# EAGLE design conrad (EAGLE 7.6.0)
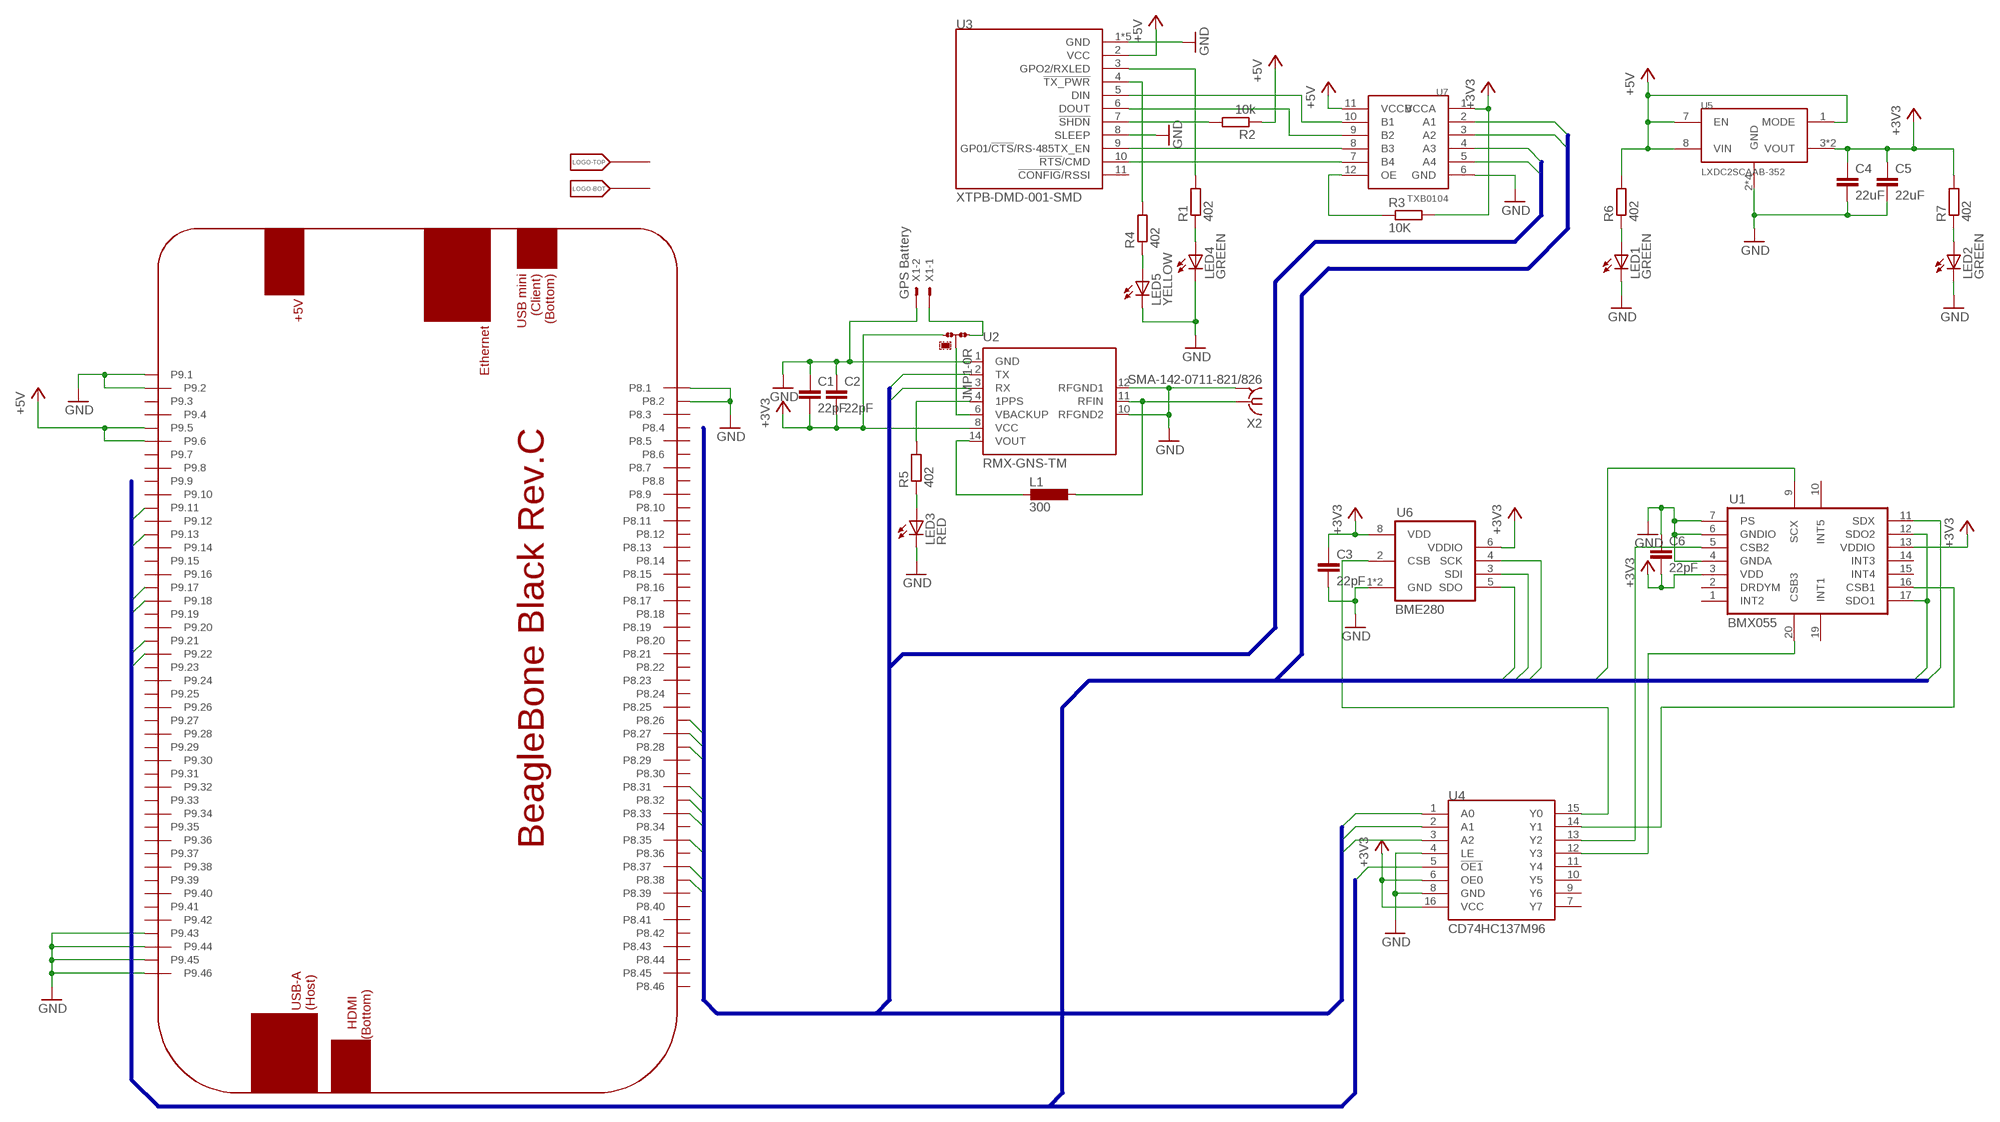
[diagram p0: schematic, sheet 1]

## Parts
C1  22pF  C-EUC0603K  [C0603K]
C2  22pF  C-EUC0603K  [C0603K]
C3  22pF  C-EUC0603K  [C0603K]
C4  22uF  C-EUC0603K  [C0603K]
C5  22uF  C-EUC0603K  [C0603K]
C6  22pF  C-EUC0603K  [C0603K]
JMP1  0R-JUMPB  [B0R-JMP]
L1  300  L-EU  [L0402]
LED1  GREEN  LEDSML0805  [SML0805]
LED2  GREEN  LEDSML0805  [SML0805]
LED3  RED  LEDSML0805  [SML0805]
LED4  GREEN  LEDSML0805  [SML0805]
LED5  YELLOW  LEDSML0805  [SML0805]
LOGO  SU_LOGO-DUMMY  [SU_LOGO_DS]
PCB1  BEAGLEBONE_BLACK_CAPE  [BEAGLEBONE_BLACK_CAPE]
R1  402  R-EU_R0603  [R0603]
R2  10k  R-EU_R0603  [R0603]
R3  10K  R-EU_R0603  [R0603]
R4  402  R-EU_R0603  [R0603]
R5  402  R-EU_R0603  [R0603]
R6  402  R-EU_R0603  [R0603]
R7  402  R-EU_R0603  [R0603]
U1  BMX055  [BMX055]
U2  RMX-GNS-TM  [RMX-GNSS-TM]
U3  XTPB-DMD-001-SMD  [XTP9B-DMS-001-SMD]
U4  CD74HC137M96  CD74HC237M96  [SO-16]
U5  LXDC2SCAAB-352  [LXDC2SCAAB-352]
U6  BME280  [BME280]
U7  TXB0104  [R-PUQFN-N12]
X1  GPS Battery  C-GRID-02-15-19  [15-91-02]
X2  SMA-142-0711-821/826  [J502-ND-142-0711-821/826]

## Nets
+3V3: C1.2 C2.2 C3.1 C4.1 C5.1 C6.2 JMP1.3 R3.2 R7.2 U1.3(VDD) U1.13(VDDIO) U2.8(VCC) U4.6(OE0) U4.16(VCC) U5.3(VOUT) U5.4(VOUT) U6.6(VDDIO) U6.8(VDD) U7.1(VCCA)
+5V: PCB1.P9.5 PCB1.P9.6 R2.1 R6.2 U3.2(VCC) U5.1(MODE) U5.7(EN) U5.8(VIN) U7.11(VCCB)
GND: C1.1 C2.1 C3.2 C4.2 C5.2 C6.1 LED1.C LED2.C LED3.C LED4.C LED5.C PCB1.P8.1 PCB1.P8.2 PCB1.P9.1 PCB1.P9.2 PCB1.P9.43 PCB1.P9.44 PCB1.P9.45 PCB1.P9.46 U1.4(GNDA) U1.6(GNDIO) U1.7(PS) U2.1(GND) U2.10(RFGND2) U2.12(RFGND1) U3.1(GND) U3.8(SLEEP) U3.P$1(GND) U3.P$2(GND) U3.P$3(GND) U3.P$4(GND) U4.4(LE) U4.8(GND) U5.2(GND) U5.5(GND) U5.6(GND) U5.9(GND) U6.1(GND) U6.7(GND) U7.6(GND) X1.2 X2.G@1 X2.G@2 X2.G@3 X2.G@4
N$1: R3.1 U7.12(OE)
N$2: LED4.A R1.1
N$3: U3.6(DOUT) U7.9(B2)
N$4: R4.2 U3.4(!TX_PWR!)
N$5: L1.1 U2.11(RFIN) X2.1
N$6: JMP1.1 X1.1
N$7: U4.15(Y0) U6.2(CSB)
N$8: U1.5(CSB2) U4.13(Y2)
N$9: L1.2 U2.14(VOUT)
N$10: U1.16(CSB1) U4.14(Y1)
N$11: R1.2 U3.3(GPO2/RXLED)
N$12: U1.20(CSB3) U4.12(Y3)
N$13: R5.2 U2.4(1PPS)
N$14: LED5.A R4.1
N$15: R2.2 U3.7(!SHDN!)
N$16: LED3.A R5.1
N$17: LED1.A R6.1
N$18: LED2.A R7.1
SPI0_CS0: PCB1.P9.17 U4.5(!OE1!)
SPI0_D0: PCB1.P9.21 U1.12(SDO2) U1.17(SDO1) U6.5(SDO)
SPI0_D1: PCB1.P9.18 U1.11(SDX) U6.3(SDI)
SPI0_SCLK: PCB1.P9.22 U1.9(SCX) U6.4(SCK)
SPI_CSB26: PCB1.P8.26 U4.1(A0)
SPI_CSB27: PCB1.P8.27 U4.2(A1)
SPI_CSB28: PCB1.P8.28 U4.3(A2)
UART4_CTSN: PCB1.P8.35 U7.4(A3)
UART4_CTSN_HV: U3.9(GP01/!CTS!/RS-485TX_EN) U7.8(B3)
UART4_RTSN: PCB1.P8.33 U7.5(A4)
UART4_RTSN_HV: U3.10(!RTS!/CMD) U7.7(B4)
UART4_RXD: PCB1.P9.11 U7.3(A2)
UART4_TXD: PCB1.P9.13 U7.2(A1)
UART4_TXD-HV: U3.5(DIN) U7.10(B1)
UART5_CTSN: PCB1.P8.31
UART5_RTSN: PCB1.P8.32
UART5_RXD: PCB1.P8.38 U2.2(TX)
UART5_TXD: PCB1.P8.37 U2.3(RX)
VBACKUP: JMP1.2 U2.6(VBACKUP)
Unconnected: LOGO.P$1 LOGO.P$2 PCB1.P8.3 PCB1.P8.4 PCB1.P8.5 PCB1.P8.6 PCB1.P8.7 PCB1.P8.8 PCB1.P8.9 PCB1.P8.10 PCB1.P8.11 PCB1.P8.12 PCB1.P8.13 PCB1.P8.14 PCB1.P8.15 PCB1.P8.16 PCB1.P8.17 PCB1.P8.18 PCB1.P8.19 PCB1.P8.20 PCB1.P8.21 PCB1.P8.22 PCB1.P8.23 PCB1.P8.24 PCB1.P8.25 PCB1.P8.29 PCB1.P8.30 PCB1.P8.34 PCB1.P8.36 PCB1.P8.39 PCB1.P8.40 PCB1.P8.41 PCB1.P8.42 PCB1.P8.43 PCB1.P8.44 PCB1.P8.45 PCB1.P8.46 PCB1.P9.3 PCB1.P9.4 PCB1.P9.7 PCB1.P9.8 PCB1.P9.9 PCB1.P9.10 PCB1.P9.12 PCB1.P9.14 PCB1.P9.15 PCB1.P9.16 PCB1.P9.19 PCB1.P9.20 PCB1.P9.23 PCB1.P9.24 PCB1.P9.25 PCB1.P9.26 PCB1.P9.27 PCB1.P9.28 PCB1.P9.29 PCB1.P9.30 PCB1.P9.31 PCB1.P9.32 PCB1.P9.33 PCB1.P9.34 PCB1.P9.35 PCB1.P9.36 PCB1.P9.37 PCB1.P9.38 PCB1.P9.39 PCB1.P9.40 PCB1.P9.41 PCB1.P9.42 U1.1(INT2) U1.2(DRDYM) U1.10(INT5) U1.14(INT3) U1.15(INT4) U1.19(INT1) U3.11(!CONFIG!/RSSI) U4.7(Y7) U4.9(Y6) U4.10(Y5) U4.11(Y4)

## Buses
P8:UART4_RTSN,UART4_CTSN,UART5_CTSN,UART5_RTSN,UART5_TXD,UART5_RXD,SPI_CSB[26..28]
P9:UART4_RXD,UART4_TXD,SPI0_CS0,SPI0_D1,SPI0_D0,SPI0_SCLK

## Library data of the parts
C1-C6 = resistor:C-EU: CAPACITOR, European symbol
JMP1 = jump-0r-smd:0R-JUMP: SMD 0R 0805 Jumper
L1 = components:L-EU
LED1-LED5 = led:LED: LED OSRAM: - CHIPLED LG R971, LG N971, LY N971, LG Q971, LY Q971, LO R971, LY R971 LH N974, LH R974 LS Q976, LO Q976, LY Q976 LO Q996 - Hyper CHIPLED LW Q18S LB Q993, LB Q99A, LB R99A - SideLED LS A670, LO A670, LY A670, LG A670, LP A670 LB A673, LV A673, LT A673, LW A673 LH A674 LY A675 LS A676, LA A676, LO A676, LY A676, LW A676 LS A679, LY A679, LG A679 - Hyper Micro SIDELED® LS Y876, LA Y876, LO Y876, LY Y876 LT Y87S - SmartLED LW L88C, LW L88S LB L89C, LB L89S, LG L890 LS L89K, LO L89K, LY L89K LS L896, LA L896, LO L896, LY L896 - TOPLED LS T670, LO T670, LY T670, LG T670, LP T670 LSG T670, LSP T670, LSY T670, LOP T670, LYG T670 LG T671, LOG T671, LSG T671 LB T673, LV T673, LT T673, LW T673 LH T674 LS T676, LA T676, LO T676, LY T676, LB T676, LH T676, LSB T676, LW T676 LB T67C, LV T67C, LT T67C, LS T67K, LO T67K, LY T67K, LW E67C LS E67B, LA E67B, LO E67B, LY E67B, LB E67C, LV E67C, LT E67C LW T67C LS T679, LY T679, LG T679 LS T770, LO T770, LY T770, LG T770, LP T770 LB T773, LV T773, LT T773, LW T773 LH T774 LS E675, LA E675, LY E675, LS T675 LS T776, LA T776, LO T776, LY T776, LB T776 LHGB T686 LT T68C, LB T68C - Hyper Mini TOPLED® LB M676 - Mini TOPLED Santana® LG M470 LS M47K, LO M47K, LY M47K Source: http://www.osram.convergy.de LUXEON: - LUMILED® LXK2-PW12-R00, LXK2-PW12-S00, LXK2-PW14-U00, LXK2-PW14-V00 LXK2-PM12-R00, LXK2-PM12-S00, LXK2-PM14-U00 LXK2-PE12-Q00, LXK2-PE12-R00, LXK2-PE12-S00, LXK2-PE14-T00, LXK2-PE14-U00 LXK2-PB12-K00, LXK2-PB12-L00, LXK2-PB12-M00, LXK2-PB14-N00, LXK2-PB14-P00, LXK2-PB14-Q00 LXK2-PR12-L00, LXK2-PR12-M00, LXK2-PR14-Q00, LXK2-PR14-R00 LXK2-PD12-Q00, LXK2-PD12-R00, LXK2-PD12-S00 LXK2-PH12-R00, LXK2-PH12-S00 LXK2-PL12-P00, LXK2-PL12-Q00, LXK2-PL12-R00 Source: www.luxeon.com KINGBRIGHT: KA-3528ASYC Source: www.kingbright.com
LOGO = components:SU_LOGO-DUMMY
PCB1 = e14_BeagleBoneBlack_RevB:BEAGLEBONE_BLACK_CAPE
R1-R7 = rcl:R-EU_: RESISTOR, European symbol
U1 = bosch:BMX055: BOSH BMX055 Accelerometer
U2 = linx:RMX-GNS-TM: RMX-GNS-TM GNSS Reciver Module
U3 = XTend:XTPB-DMD-001-SMD: XTP9B-DMS-001-SMD board footprint with smd connector
U4 = texas:CD74HC237M96: CD74HC237M96 3 bit demultiplexer High output
U5 = murata:LXDC2SCAAB-352: LXDC2SCAAB-352 Micro DC-DC converter 1.2A max 2.8-5.0V input range 3.3V output
U6 = bosch:BME280: DIGITAL HUMIDITY, PRESSURE AND TEMPERATURE SENSOR * Digital interface I²C (up to 3.4 MHz) and SPI (3 and 4 wire, up to 10 MHz)* Supply voltage VDD main supply voltage range: 1.71 V to 3.6 V*VDDIO interface voltage range: 1.2 V to 3.6 V Operating range -40…+85 °C, 0…100 % rel. humidity, 300…1100 hPa The library has been designed by Richard Magdycz <https://www.facebook.com/groups/eaglecadsoftUK>
U7 = texas:TXB0104: Voltage-Level Translator 1.2V to 3.6V on A port and 1.65V to 5.5V on B port Voltage translator.
X1 = con-molex:C-GRID-02: CONNECTOR wire to board 2.54 mm (0.100") pitch header; OC_FARNELL: unknown; OC_NEWARK: unknown
X2 = con-coax:SMA-: SMA 50 Ohm End Launch Jack Receptacle - Round Contact Johnson Components Source: www.johnsoncomponents.com .. J502-ND.pdf; MF: JOHNSON COMPONENTS; MPN: 142-0711-821; OC_FARNELL: 1019328; OC_NEWARK: 16F3627

## Board
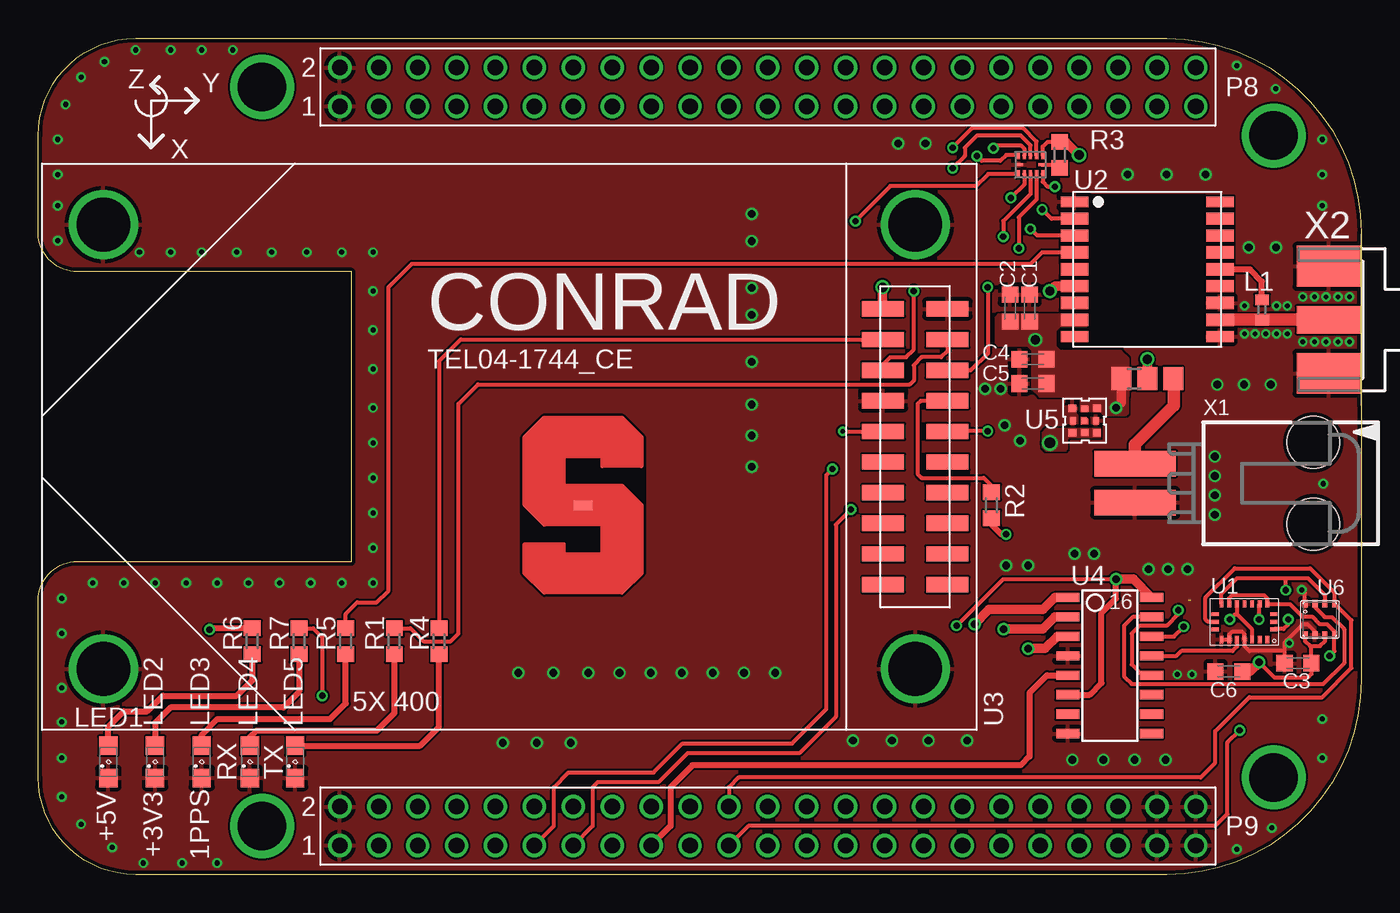
[diagram p1: board, top side]
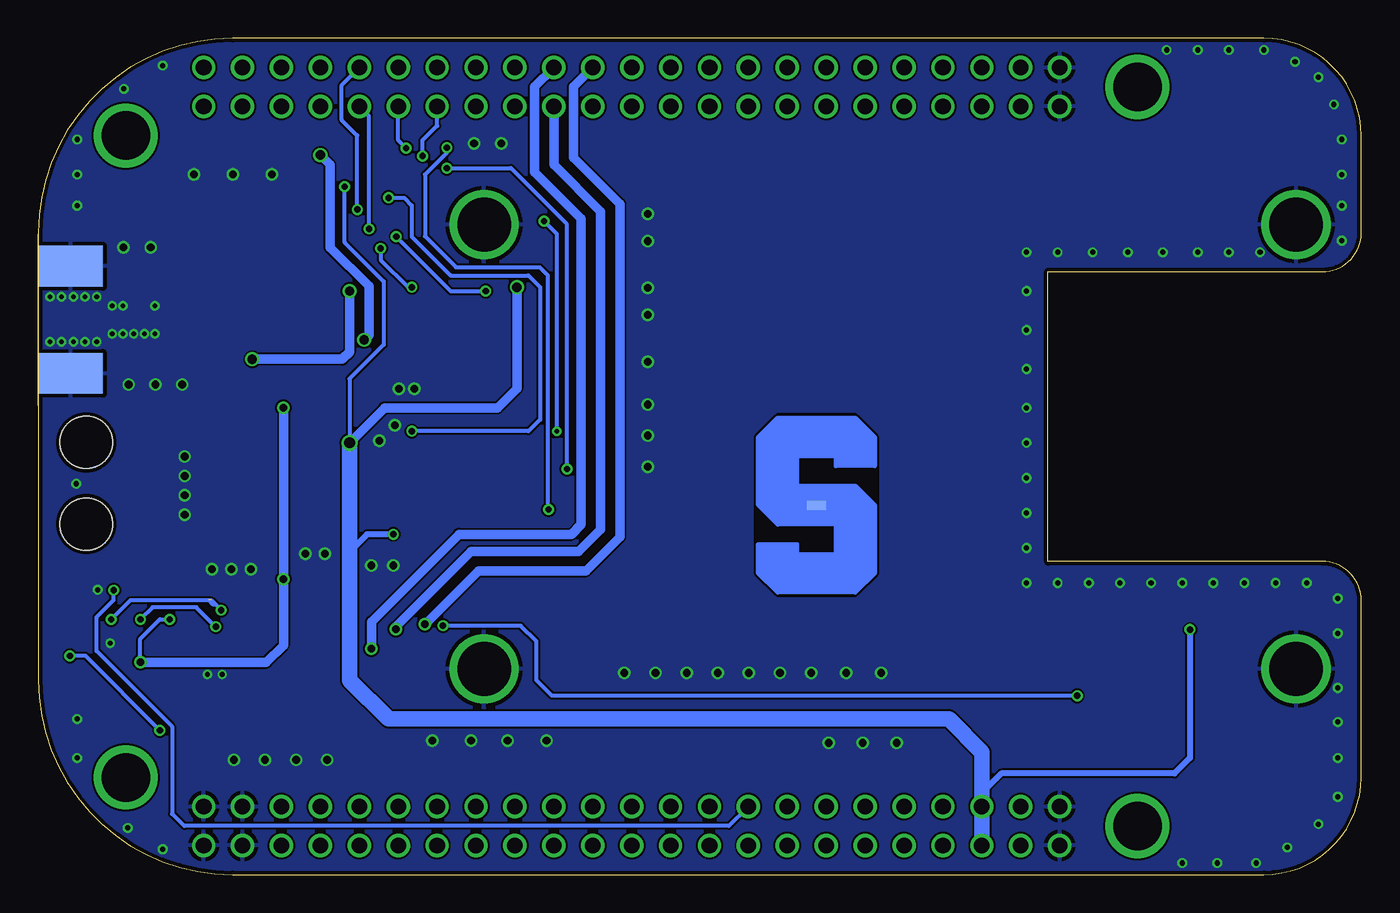
[diagram p2: board, bottom side, seen from below]

Size 86.36 x 54.61 mm. Coordinates in mm from the lower left corner, seen from the top.
Copper layers (1*16): Top 0.035mm / dielectric 1.5mm / Bottom 0.035mm
Design rules "DirtyPCBs-2layer": minimum track width 5mil, minimum drill 12mil, track to track 5mil, track to pad 5mil, pad to pad 5mil, via to via 5mil, smd to smd 0mil, copper to edge 10mil, drill to drill 10mil, minimum pad ring 10mil, minimum via ring 6mil, stop-mask expansion 2mil, vias tented up to drill 25mil, thermal gap 10mil
tRestrict: area 68.6,34.5 to 76.2,44.5; area 31.6,18.3 to 39.5,30
bRestrict: area 31.6,18.3 to 39.5,30

### Footprints (pad centres in the part's own frame; a part is rotated, then mirrored left to right if it is on the bottom)
C0603K = smd 1.05 x 1.08: 1 -0.875,0; 2 0.875,0
B0R-JMP = smd 1.5 x 1.3: 1 0,1.7; 2 0,0; 3 0,-1.7
L0402 = smd 0.7 x 0.9: 1 -0.65,0; 2 0.65,0
SML0805 = smd 1.2 x 1.2: A 1.05,0; C -1.05,0
SU_LOGO_DS = smd 1.27 x 0.635: P$1 0,0 | smd 1.27 x 0.635 bottom: P$2 0,0
BEAGLEBONE_BLACK_CAPE = drill 3.175: H1 14.605,3.175; H2 80.645,6.35; H3 80.645,48.26; H4 14.605,51.435 | drill 1.016: P8.1 19.685,50.165; P8.2 19.685,52.705; P8.3 22.225,50.165; P8.4 22.225,52.705; P8.5 24.765,50.165; P8.6 24.765,52.705; P8.7 27.305,50.165; P8.8 27.305,52.705; P8.9 29.845,50.165; P8.10 29.845,52.705; P8.11 32.385,50.165; P8.12 32.385,52.705; P8.13 34.925,50.165; P8.14 34.925,52.705; P8.15 37.465,50.165; P8.16 37.465,52.705; P8.17 40.005,50.165; P8.18 40.005,52.705; P8.19 42.545,50.165; P8.20 42.545,52.705; P8.21 45.085,50.165; P8.22 45.085,52.705; P8.23 47.625,50.165; P8.24 47.625,52.705; P8.25 50.165,50.165; P8.26 50.165,52.705; P8.27 52.705,50.165; P8.28 52.705,52.705; P8.29 55.245,50.165; P8.30 55.245,52.705; P8.31 57.785,50.165; P8.32 57.785,52.705; P8.33 60.325,50.165; P8.34 60.325,52.705; P8.35 62.865,50.165; P8.36 62.865,52.705; P8.37 65.405,50.165; P8.38 65.405,52.705; P8.39 67.945,50.165; P8.40 67.945,52.705; P8.41 70.485,50.165; P8.42 70.485,52.705; P8.43 73.025,50.165; P8.44 73.025,52.705; P8.45 75.565,50.165; P8.46 75.565,52.705; P9.1 19.685,1.905; P9.2 19.685,4.445; P9.3 22.225,1.905; P9.4 22.225,4.445; P9.5 24.765,1.905; P9.6 24.765,4.445; P9.7 27.305,1.905; P9.8 27.305,4.445; P9.9 29.845,1.905; P9.10 29.845,4.445; P9.11 32.385,1.905; P9.12 32.385,4.445; P9.13 34.925,1.905; P9.14 34.925,4.445; P9.15 37.465,1.905; P9.16 37.465,4.445; P9.17 40.005,1.905; P9.18 40.005,4.445; P9.19 42.545,1.905; P9.20 42.545,4.445; P9.21 45.085,1.905; P9.22 45.085,4.445; P9.23 47.625,1.905; P9.24 47.625,4.445; P9.25 50.165,1.905; P9.26 50.165,4.445; P9.27 52.705,1.905; P9.28 52.705,4.445; P9.29 55.245,1.905; P9.30 55.245,4.445; P9.31 57.785,1.905; P9.32 57.785,4.445; P9.33 60.325,1.905; P9.34 60.325,4.445; P9.35 62.865,1.905; P9.36 62.865,4.445; P9.37 65.405,1.905; P9.38 65.405,4.445; P9.39 67.945,1.905; P9.40 67.945,4.445; P9.41 70.485,1.905; P9.42 70.485,4.445; P9.43 73.025,1.905; P9.44 73.025,4.445; P9.45 75.565,1.905; P9.46 75.565,4.445
R0603 = smd 1 x 1.1: 1 -0.85,0; 2 0.85,0
BMX055 = smd 0.25 x 0.475: 1 -1.5,1.163; 2 -1,1.163; 3 -0.5,1.163; 4 0,1.163; 5 0.5,1.163; 6 1,1.163; 7 1.5,1.163; 11 1.5,-1.163; 12 1,-1.163; 13 0.5,-1.163; 14 0,-1.163; 15 -0.5,-1.163; 16 -1,-1.163; 17 -1.5,-1.163 | smd 0.475 x 0.25: 8 1.913,0.5; 9 1.913,0; 10 1.913,-0.5; 18 -1.913,-0.5; 19 -1.913,0; 20 -1.913,0.5
RMX-GNSS-TM = smd 1.8 x 0.7: 1 -4.75,4.4; 9 -4.75,-4.4; 10 4.75,-4.4; 18 4.75,4.4 | smd 1.8 x 0.8: 2 -4.75,3.3; 3 -4.75,2.2; 4 -4.75,1.1; 5 -4.75,0; 6 -4.75,-1.1; 7 -4.75,-2.2; 8 -4.75,-3.3; 11 4.75,-3.3; 12 4.75,-2.2; 13 4.75,-1.1; 14 4.75,0; 15 4.75,1.1; 16 4.75,2.2; 17 4.75,3.3
XTP9B-DMS-001-SMD = smd 1 x 2.75: 1 9,-28.87; 2 9,-24.67; 3 7,-28.87; 4 7,-24.67; 5 5,-28.87; 6 5,-24.67; 7 3,-28.87; 8 3,-24.67; 9 1,-28.87; 10 1,-24.67; 11 -1,-28.87; 12 -1,-24.67; 13 -3,-28.87; 14 -3,-24.67; 15 -5,-28.87; 16 -5,-24.67; 17 -7,-28.87; 18 -7,-24.67; 19 -9,-28.87; 20 -9,-24.67 | drill 3.5: P$1 -14.5,-26.77; P$2 14.5,-26.77; P$3 -14.5,26.23; P$4 14.5,26.23
SO-16 = smd 0.61 x 1.524: 1 -4.445,-2.794; 2 -3.175,-2.794; 3 -1.905,-2.794; 4 -0.635,-2.794; 5 0.635,-2.794; 6 1.905,-2.794; 7 3.175,-2.794; 8 4.445,-2.794; 9 4.445,2.667; 10 3.175,2.667; 11 1.905,2.667; 12 0.635,2.667; 13 -0.635,2.667; 14 -1.905,2.667; 15 -3.175,2.667; 16 -4.445,2.667
LXDC2SCAAB-352 = smd 0.5 x 0.5: 1 0.8,0.8; 3 -0.8,0.8; 5 -0.8,-0.8; 7 0.8,-0.8 | smd 0.5 x 0.39: 2 0,0.75; 6 0,-0.75 | smd 0.44 x 0.5: 4 -0.77,0; 8 0.78,0 | smd 0.4 x 0.4: 9 0.03,-0.03
BME280 = smd 0.35 x 0.5: 1 0.975,-1.025; 2 0.325,-1.025; 3 -0.325,-1.025; 4 -0.975,-1.025; 5 -0.975,1.025; 6 -0.325,1.025; 7 0.325,1.025; 8 0.975,1.025
R-PUQFN-N12 = smd 0.2 x 0.5: 1 -0.8,-0.6; 2 -0.4,-0.6; 3 0,-0.6; 4 0.4,-0.6; 5 0.8,-0.6; 7 0.8,0.6; 8 0.4,0.6; 9 0,0.6; 10 -0.4,0.6; 11 -0.8,0.6 | smd 0.5 x 0.2: 6 0.75,0; 12 -0.75,0
15-91-02 = smd 1.651 x 5.334: 1 -1.27,-10.795; 2 1.27,-10.795 | hole 3.404: -2.667,0.838; 2.667,0.838
J502-ND-142-0711-821/826 = smd 4.191 x 1.778: 1 2.115,0 | smd 4.191 x 2.667: G@1 2.115,3.495; G@2 2.115,-3.495 | smd 4.191 x 2.667 bottom: G@3 2.115,3.495; G@4 2.115,-3.495

### Placement (x,y rotation side)
C1  64.71,36.99 270 top
C2  63.44,36.99 270 top
C3  82.23,13.81 180 top
C4  64.93,33.66 180 top
C5  64.93,32.07 180 top
C6  77.72,13.27 0 top
JMP1  72.39,32.38 270 top
L1  79.88,36.88 90 top
LED1  4.57,7.37 90 top
LED2  7.62,7.37 90 top
LED3  10.67,7.37 90 top
LED4  13.81,7.37 90 top
LED5  16.76,7.37 90 top
LOGO  35.56,24.13 0 top
PCB1  0,0 0 top
R1  23.24,15.24 90 top
R2  62.23,24.13 90 top
R3  66.67,46.99 90 top
R4  26.16,15.24 90 top
R5  20.07,15.24 90 top
R6  13.97,15.24 90 top
R7  17.02,15.24 90 top
U1  78.74,16.51 180 top
U2  72.39,39.53 0 top
U3  30.48,27.94 90 top
U4  70.01,13.65 270 top
U5  68.3,29.64 270 top
U6  83.66,16.67 180 top
U7  64.77,46.35 180 top
X1  82.39,25.56 270 top
X2  86.36,36.23 180 top

### Tracks (layer width: path | path; a pad name or v marks a point on that pad's centre or on a via)
+3V3  (via drill 0.41, 0.5, 0.51, 0.6, 0.61)
  Top 0.254: U6.8 82.69,15.26 83.03,14.92 | U6.6 83.99,15.25 83.66,14.92 83.03,14.92 | 83.03,14.92 83.11,14.85 C3.1 83.11,13.1 82.87,12.86 80.71,12.86 v79.69,13.88 | U1.3 79.24,16.01 78.26,16.99 | 78.26,16.99 78.26,17.65 U1.13 | v77.79,16.67 78.11,16.99 78.26,16.99 | U7.1 65.57,47.54 65.87,47.84 R3.2 | R7.2 17.95,16.09 18.54,15.49 v18.54,11.68 | v59.94,16.26 62.99,19.3 v70.36,19.3
  Top 0.406: U4.6 68.64,11.75 69.41,12.51 69.41,17.08 70.36,18.03 v70.36,19.3
  Top 0.61: 70.48,32.59 JMP1.3 70.69,30.81 v70.36,30.48 | U2.8 67.53,36.11 | v70.36,19.3 71.47,19.3 U4.16 | R3.2 67.09,47.84 v67.94,46.99 | C6.2 79.09,13.27 v79.69,13.88
  Bottom 0.254: v79.69,13.88 79.69,15.4 78.42,16.67 v77.79,16.67 | v18.54,11.68 52.83,11.68 53.85,12.7 53.85,15.24 54.86,16.26 v59.94,16.26
  Bottom 0.61: v70.36,30.48 v70.36,19.3 70.36,14.99 71.47,13.88 v79.69,13.88 | v65.09,34.92 64.77,35.24 64.77,38.42 67.31,40.96 67.31,46.35 v67.94,46.99
  pour Top (isolate 0.127, no thermals): 71.12,31.27 71.12,33.66 70.64,34.13 66.67,34.13 66.36,34.45 66.36,35.56 66.67,35.88 68.58,35.88 68.58,36.51 62.71,36.51 62.55,36.35 62.55,34.77 62.71,34.61 64.61,34.61 64.93,34.29 64.93,31.75 65.41,31.27
  pour Top (no thermals): 68.07,30.23 68.07,31.24 71.12,31.24 71.12,30.1 70.99,29.97 69.6,29.97 69.34,30.23
+5V  (via drill 0.41, 0.61, 0.7)
  Top 0.254: U7.11 65.57,45.24 65.88,44.93 v66.36,44.93
  Top 0.406: R2.1 62.23,22.86 62.87,22.23 v63.18,22.23 | R6.2 11.26,16.09 v11.18,16
  Top 0.61: U3.2 55.12,36.97 v55.12,38.35
  Bottom 0.254: 66.52,44.93 v66.36,44.93 66.36,41.27 63.82,38.73 63.82,34.61 66.04,32.38 v66.04,28.19
  Bottom 0.406: v11.18,16 11.18,7.62 12.19,6.6 23.5,6.6 24.77,5.33 | v63.18,22.23 64.9,22.23 66.04,21.08
  Bottom 0.61: v55.12,38.35 55.12,31.75 56.39,30.48 63.75,30.48 v66.04,28.19
  Bottom 1.016: v66.04,28.19 66.04,21.08 66.04,12.7 63.5,10.16 26.92,10.16 24.77,8 24.77,5.33 PCB1.P9.6 PCB1.P9.5
  pour Top (no thermals): 69.34,29.08 65.79,29.08 65.53,28.83 65.53,27.94 65.79,27.69 67.06,27.69 67.18,27.81 67.18,28.45 67.31,28.57 69.34,28.57
GND  (via drill 0.3, 0.33, 0.5)
  Top 0.254: U6.7 83.34,15.88 82.87,16.35 82.55,16.35 81.36,15.16 81.36,14.61 | C3.2 81.36,14.61 | U1.7 U1.6 77.74,15.67 77.95,15.88 78.58,15.88 78.74,15.72 U1.4 78.74,14.92 79.06,14.61 81.36,14.61 | U6.1 82.69,18.42 v82.49,18.61
  Top 0.813: 64.14,31.99 C5.2
  other vias: 60.64,8.76 58.1,8.76 55.72,8.76 53.18,8.76 73.66,45.72 71.12,45.72 76.2,45.72 80.45,32 78.71,32 76.96,32 80.8,40.96 30.32,8.6 32.54,8.6 34.77,8.6 11.68,0.76 9.4,0.76 6.86,0.76 2.79,3.3 1.52,5.08 1.52,7.62 1.52,9.97 1.27,45.72 1.27,48.01 1.78,50.29 4.32,53.09 6.35,53.85 8.64,53.85 10.67,53.85 78.23,52.83 83.82,48.01 80.77,51.31 83.82,45.72 83.82,43.69 83.88,25.53 83.82,10.16 83.82,7.62 80.52,3.05 78.23,1.65 5.59,19.05 7.62,19.05 9.65,19.05 11.68,19.05 13.72,19.05 15.75,19.05 17.78,19.05 21.84,19.05 21.84,21.34 21.84,23.62 21.84,25.91 21.84,28.19 21.84,30.48 21.84,33.02 21.84,35.56 21.84,38.1 21.84,40.64 19.81,40.64 17.53,40.64 15.24,40.64 12.95,40.64 10.67,40.64 8.64,40.64 64.61,20.19 63.18,20.19 4.83,1.78 3.56,19.05 19.81,19.05 6.6,40.64 2.79,52.07 12.7,53.85 1.52,15.75 1.52,12.19 1.52,18.03 31.34,13.18 33.62,13.18 35.91,13.18 37.94,13.18 39.97,13.18 42.01,13.18 44.04,13.18 46.07,13.18 48.1,13.18 72.49,19.94 73.76,19.94 75.03,19.94 61.82,31.72 62.83,31.72 46.58,33.5 46.58,30.7 57.91,47.75 56.13,47.75 78.74,35.31 79.44,35.31 80.14,35.31 80.84,35.31 81.53,35.31 81.53,37.15 80.84,37.15 78.74,37.15 74.36,13.08 75.31,13.08 67.5,7.49 69.53,7.49 71.56,7.49 73.6,7.49 46.58,36.54 46.58,38.32 46.58,41.37 46.58,43.15 46.58,28.67 46.58,26.64 81.66,15.11 1.27,43.69 1.27,41.4 63.09,29.34 64.1,28.32 67.66,20.95 68.93,20.95 76.8,23.5 76.8,24.77 76.8,26.04 76.8,27.3 79.03,40.96 82.55,34.8 83.31,34.8 84.07,34.8 84.84,34.8 85.6,34.8 82.55,37.72 83.31,37.72 84.07,37.72 84.84,37.72 85.6,37.72
  pour Top (rank 6): 0,48.26 arc-90 6.1,54.61 73.91,54.61 arc-90 86.36,41.91 86.36,12.7 arc-90 73.66,0 6.35,0 arc-90 0,6.1
  pour Bottom (rank 6): 0,48.26 arc-90 6.1,54.61 73.91,54.61 arc-90 86.36,41.91 86.36,12.7 arc-90 73.66,0 6.35,0 arc-90 0,6.1
  pour Top (no thermals): 69.22,29.84 69.22,29.46 66.42,29.46 66.42,30.61 67.69,30.61 67.69,30.1 67.94,29.84
N$1
  Top 0.254: U7.12 66.46,46.35 R3.1
N$2
  Top 0.406: R1.1 23.24,10.54 22.1,9.4 14.22,9.4 13.81,8.98 LED4.A
N$3  (via drill 0.41)
  Top 0.254: U7.9 64.77,44.45 62.99,42.67 v62.99,41.66 | U3.6 55.15,33.31 55.63,33.78 56.64,33.78 57.15,34.29 v57.15,38.1
  Bottom 0.254: v62.99,41.66 59.44,38.1 v57.15,38.1
N$4
  Top 0.254: R4.2 26.16,33.53 27.57,34.94 U3.4
N$5
  Top 0.8: U2.11 L1.1 X2.1
N$6
  Top 0.813: X1.1 71.6,28.1 74.14,30.64 74.14,32.23 JMP1.1
N$7
  Top 0.254: U6.2 83.34,17.47 83.98,16.83 84.45,16.83 85.25,16.03 85.25,13.81 83.88,12.45 71.37,12.45 70.87,12.95 70.87,16.26 71.44,16.83 U4.15
N$8
  Top 0.254: U1.5 78.24,14.9 77.95,14.61 74.61,14.61 74.3,14.29 U4.13
N$9
  Top 0.406: U2.14 79.09,39.53 79.88,38.74 L1.2
N$10  (via drill 0.41 pad 0.25)
  Top 0.254: v79.69,16.67 79.69,17.62 U1.16 | U4.14 74.14,15.56 v74.77,16.19
  Bottom 0.254: v74.77,16.19 76.04,17.46 78.9,17.46 v79.69,16.67
N$11
  Top 0.254: U3.3 59.35,34.2 58.93,33.78 57.66,33.78 57.15,33.27 57.15,32.26 56.9,32 28.7,32 27.43,30.73 27.43,15.75 26.92,15.24 25.15,15.24 24.3,16.09 R1.2
N$12  (via drill 0.41, 0.41 pad 0.25)  (1 unrouted)
  Top 0.254: v81.6,16.67 81.6,16.35 81.28,16.03 80.68,16.03 U1.20 | U4.12 72.07,13.02 71.37,13.72 71.37,15.75 71.88,16.26 73.66,16.26 74.42,17.02 v74.42,17.27
  Bottom 0.254: 74.93,17.62 75.25,17.94 | v81.6,16.67 80.33,17.94 75.09,17.94 v74.42,17.27
N$13
  Top 0.254: U2.4 65.52,40.63 64.77,39.88 24.38,39.88 22.86,38.35 22.86,18.54 22.1,17.78 20.83,17.78 20.07,17.02 R5.2
N$14
  Top 0.406: LED5.A 24.93,8.42 26.16,9.65 R4.1
N$15
  Top 0.254: U3.7 57.61,30.94 57.4,30.73 57.4,26.16 57.66,25.91 61.72,25.91 62.23,25.4 R2.2
  Top 0.406: 62.07,24.94 R2.2
N$16
  Top 0.406: LED3.A 10.67,9.14 11.68,10.16 19.05,10.16 20.07,11.18 R5.1
N$17
  Top 0.406: R6.1 13.97,12.7 12.95,11.68 8.13,11.68 7.11,10.67 5.59,10.67 4.57,9.65 LED1.A
N$18
  Top 0.406: R7.1 17.02,11.94 16,10.92 8.64,10.92 7.62,9.91 LED2.A
SPI0_CS0
  Top 0.406: PCB1.P9.17 41.27,3.17 41.27,5.71 42.7,7.14 64.14,7.14 64.71,7.71 64.71,11.87 65.85,13.02 U4.5
SPI0_D0  (via drill 0.41)
  Top 0.254: U1.12 77.74,18.05 77.95,18.26 80.01,18.26 80.24,18.03 U1.17 81.7,17.67 82.55,16.83 83.19,16.83 83.66,16.35 84.14,16.35 84.64,15.85 U6.5 84.61,15.62 84.61,14.61 v84.3,14.29 | v78.42,9.43 77.63,8.64 77.63,3.97 76.83,3.17 46.35,3.17 PCB1.P9.21
  Bottom 0.254: v78.42,9.43 83.28,14.29 v84.3,14.29
SPI0_D1  (via drill 0.41)
  Top 0.254: U1.11 77.24,18.34 78.26,19.37 81.44,19.37 | 81.44,19.37 82.87,19.37 83.98,18.26 83.98,17.78 U6.3 | v81.44,18.57 81.44,19.37
  Bottom 0.254: v81.44,18.57 81.44,17.94 82.55,16.83 82.55,14.61 77.63,9.68 77.63,3.97 76.83,3.17 41.27,3.17 PCB1.P9.18
SPI0_SCLK
  Top 0.254: U1.9 76.36,16.51 76.2,16.67 76.2,18.1 78.11,20 83.03,20 84.64,18.39 U6.4 85.72,16.61 85.72,13.49 83.82,11.59 79.06,11.59 76.83,9.37 76.83,7.3 75.88,6.35 45.72,6.35 45.09,5.71 PCB1.P9.22
SPI_CSB26  (via drill 0.5)
  Top 0.61: U4.1 66.36,18.1 65.56,17.3 62.07,17.3 v61.12,16.35
  Bottom 0.61: v61.12,16.35 57.63,19.84 50.61,19.84 48.39,22.07 48.39,43.78 51.44,46.83 51.44,51.44 PCB1.P8.26
SPI_CSB27  (via drill 0.5)
  Top 0.61: U4.2 66.36,16.83 65.56,16.03 v63.02,16.03
  Bottom 0.61: v63.02,16.03 63.02,16.19 58.1,21.11 51.09,21.11 49.66,22.54 49.66,43.31 52.7,46.35 PCB1.P8.27
SPI_CSB28  (via drill 0.5)
  Top 0.61: U4.3 66.52,15.56 65.72,14.76 v64.61,14.76
  Bottom 0.61: v64.61,14.76 64.61,16.51 58.9,22.23 51.56,22.23 50.93,22.86 50.93,42.83 53.98,45.88 53.98,51.44 PCB1.P8.28
UART4_CTSN  (via drill 0.41)
  Top 0.254: v62.36,47.43 62.55,47.62 64.14,47.62 64.37,47.39 U7.4
  Bottom 0.254: v62.36,47.43 62.87,47.94 PCB1.P8.35
UART4_CTSN_HV  (via drill 0.41)
  Top 0.254: U7.8 64.37,45.07 v63.5,44.2 | v61.98,28.96 59.37,28.96 U3.9
  Bottom 0.254: v63.5,44.2 62.48,44.2 61.98,43.69 61.98,41.66 59.44,39.12 54.36,39.12 53.59,38.35 53.59,29.72 54.36,28.96 v61.98,28.96
UART4_RTSN  (via drill 0.41)
  Top 0.254: U7.5 63.94,46.99 63.18,46.99 62.8,46.61 61.59,46.61 v61.28,46.93
  Bottom 0.254: v61.28,46.93 61.28,47.94 60.33,48.9 PCB1.P8.33
UART4_RTSN_HV  (via drill 0.3, 0.41)
  Top 0.254: U7.7 62.01,45.76 61.21,44.96 55.63,44.96 v53.34,42.67 | v52.51,28.96 52.53,28.94 U3.10
  Bottom 0.254: v53.34,42.67 52.51,41.85 v52.51,28.96
UART4_RXD  (via drill 0.41)
  Top 0.254: U7.3 64.77,47.62 64.14,48.26 61.28,48.26 60.48,47.47 60.48,46.93 v59.69,46.13 | v51.85,26.48 51.44,26.07 51.44,10.79 49.21,8.57 42.07,8.57 40.16,6.67 34.61,6.67 33.66,5.71 33.66,3.17 PCB1.P9.11
  Bottom 0.254: v51.85,26.48 51.88,26.7 51.88,42.51 55.5,46.13 v59.69,46.13
UART4_TXD  (via drill 0.41, 0.41 pad 0.3)
  Top 0.254: U7.2 65.17,47.86 64.29,48.74 60.96,48.74 v59.69,47.47 | v53.05,23.84 52.07,22.86 52.07,10.32 49.69,7.94 42.39,7.94 40.48,6.03 36.51,6.03 36.2,5.71 36.2,3.17 PCB1.P9.13
  Bottom 0.254: v59.69,47.47 59.69,47.15 61.12,45.72 61.12,41.69 59.09,39.66 53.63,39.66 53.09,39.12 53.09,23.88 v53.05,23.84
UART4_TXD-HV  (via drill 0.41)
  Top 0.254: U7.10 65.17,44.09 64.01,42.93 v64.01,40.89 | v61.98,38.35 61.98,34.04 60.88,32.94 U3.5
  Bottom 0.254: v64.01,40.89 64.01,40.13 62.23,38.35 v61.98,38.35
UART5_RXD  (via drill 0.41)
  Top 0.254: U2.2 66.14,42.83 v65.53,43.43
  Bottom 0.254: v65.53,43.43 65.53,48.26 66.55,49.28 66.55,51.56 PCB1.P8.38
UART5_TXD  (via drill 0.41)
  Top 0.254: U2.3 65.2,41.73 v64.77,42.16
  Bottom 0.254: v64.77,42.16 64.77,49.53 PCB1.P8.37
VBACKUP  (via drill 0.6)
  Top 0.61: U2.6 66.37,38.43 v66.04,38.1 | v72.39,33.66 JMP1.2
  Bottom 0.61: v66.04,38.1 66.04,34.13 66.52,33.66 v72.39,33.66

### Text on the board
tPlace: Z | Y | X | CONRAD | TEL04-1744_CE | 5X 400 | RX | TX | +5V | +3V3 | 1PPS
Document: INT | EXT